# Altium project Artix Express UltraScale v2_2023-02-28T07_25_07_UTC.PrjPcb (part 7 of 7)
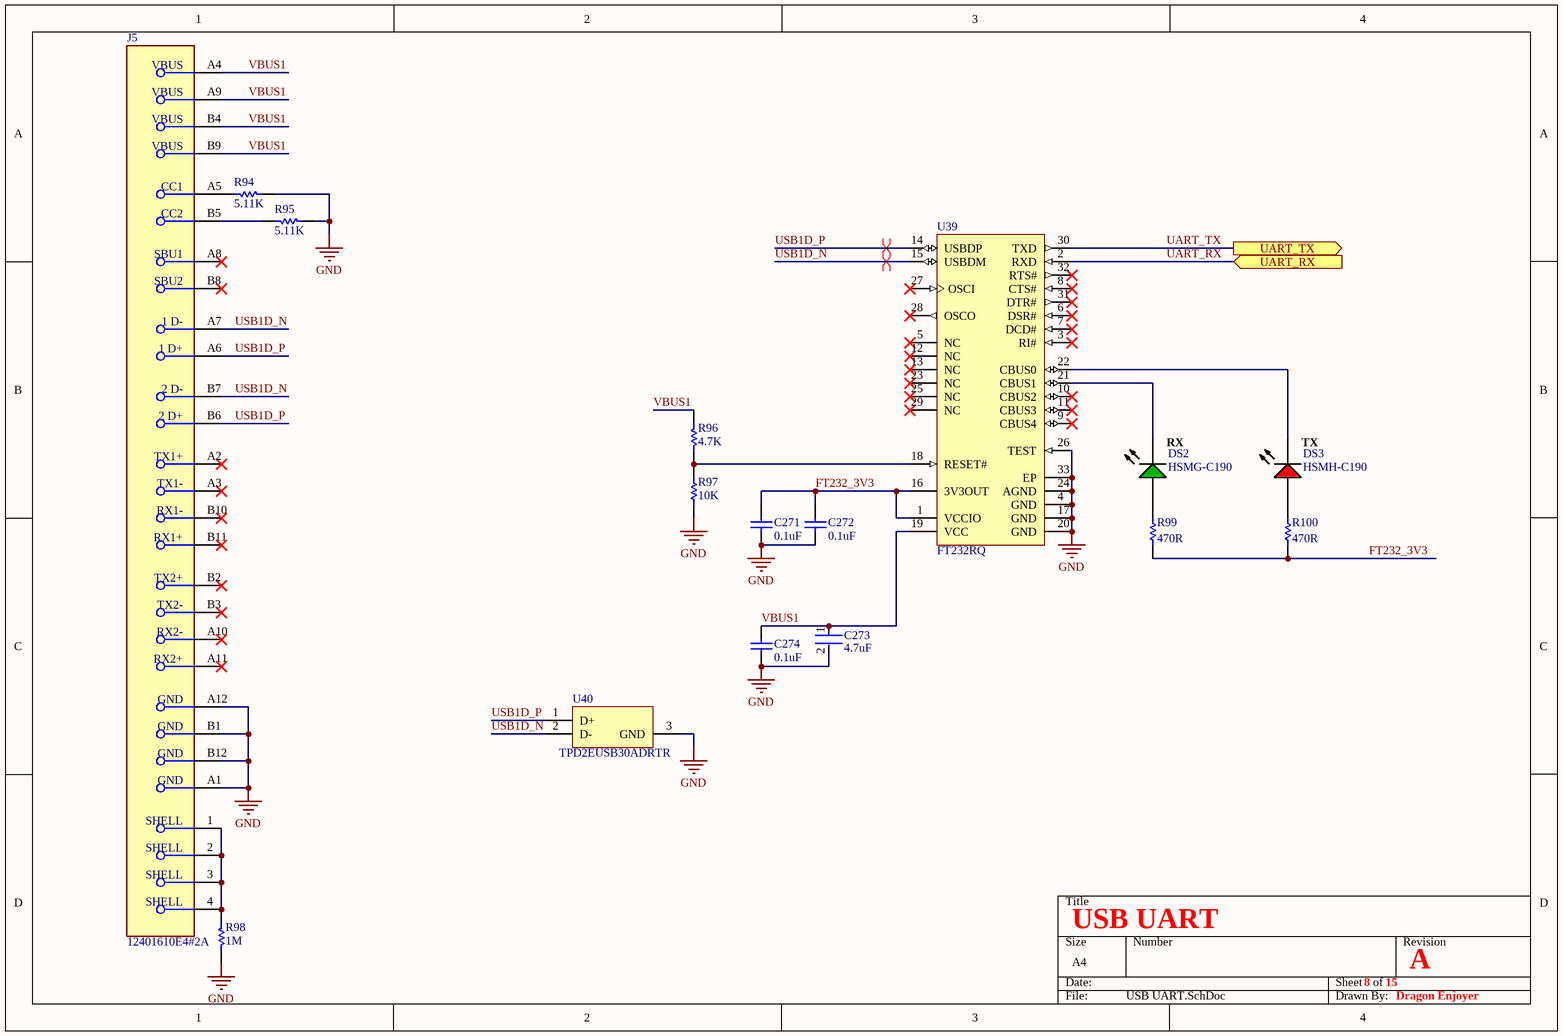
[diagram p23: USB UART.SchDoc]

## Nets that join several sheets
0.85V: FPGA Power (66 pins), Power Supplies (R1.2 U3.2)
0V9: FPGA Power (13 pins), Power Supplies (R16.2 U10.2)
1V2: DDR4 Memory (43 pins), FPGA Power (35 pins), FPGA Transcievers (R49.2 U12.AD8), Power Supplies (R9.2 U7.2)
1V8: FPGA Configuration (16 pins), FPGA IO (7 pins), FPGA Power (35 pins), Power Supplies (8 pins), USB JTAG (6 pins)
5V: Power Supplies (R3.2 U5.2), Thermal Control (U70.5)
+3V3: TopSheet (R115.2), DDR4 Memory (10 pins), FMC HPC Connector (12 pins), FPGA Configuration (5 pins), FPGA IO (25 pins), FPGA microSD (C403.2 Q3.2 R150.1 R156.2), FPGA Power (12 pins), LEDs (8 pins), Power Supplies (20 pins), Switches (8 pins), TempMonADC (7 pins), Thermal Control (U69.5), USB JTAG (18 pins)
+12: FMC HPC Connector (C195.2 C197.1 P15.C35 P15.C37), Power Supplies (39 pins), Thermal Control (C401.1 P10.2 R142.2)
GND: TopSheet (Q2.2), DDR4 Memory (58 pins), FMC HPC Connector (169 pins), FPGA Configuration (30 pins), FPGA IO (62 pins), FPGA microSD (10 pins), FPGA Power (269 pins), LEDs (16 pins), Power Supplies (94 pins), Switches (16 pins), TempMonADC (7 pins), Thermal Control (5 pins), USB JTAG (48 pins), USB UART (19 pins)
A0: DDR4 Memory (U19.L3), FPGA IO (U12.H24)
A1: DDR4 Memory (U19.L7), FPGA IO (U12.L24)
A2: DDR4 Memory (U19.M3), FPGA IO (U12.H22)
A3: DDR4 Memory (U19.K7), FPGA IO (U12.K25)
A4: DDR4 Memory (U19.K3), FPGA IO (U12.G26)
A5: DDR4 Memory (U19.L8), FPGA IO (U12.K26)
A6: DDR4 Memory (U19.L2), FPGA IO (U12.H23)
A7: DDR4 Memory (U19.M8), FPGA IO (U12.M25)
A8: DDR4 Memory (U19.M2), FPGA IO (U12.H26)
A9: DDR4 Memory (U19.M7), FPGA IO (U12.L23)
A10: DDR4 Memory (U19.J3), FPGA IO (U12.G25)
A11: DDR4 Memory (U19.N2), FPGA IO (U12.H21)
A12: DDR4 Memory (U19.J7), FPGA IO (U12.L22)
A13: DDR4 Memory (U19.N8), FPGA IO (U12.M26)
A14: DDR4 Memory (U19.H2), FPGA IO (U12.G24)
A15: DDR4 Memory (U19.H7), FPGA IO (U12.J25)
A16: DDR4 Memory (U19.H8), FPGA IO (U12.J26)
ACT_N: DDR4 Memory (U19.H3), FPGA IO (U12.J19)
BA0: DDR4 Memory (U19.K2), FPGA IO (U12.J23)
BA1: DDR4 Memory (U19.K8), FPGA IO (U12.L25)
BG0: DDR4 Memory (U19.J2), FPGA IO (U12.L18)
BG1: DDR4 Memory (U19.J8), FPGA IO (U12.J24)
CK_C: DDR4 Memory (R53.1 R54.2 U19.F8), FPGA IO (U12.F25)
CK_T: DDR4 Memory (R54.1 R55.1 U19.F7), FPGA IO (U12.F24)
CKE: DDR4 Memory (U19.G3), FPGA IO (U12.M20)
CS_N: DDR4 Memory (U19.G7), FPGA IO (U12.K18)
DDR_RST: DDR4 Memory (R56.2 U19.L1), FPGA IO (U12.J20)
DQ0: DDR4 Memory (U19.C2), FPGA IO (U12.D26)
DQ1: DDR4 Memory (U19.B7), FPGA IO (U12.B26)
DQ2: DDR4 Memory (U19.D3), FPGA IO (U12.D24)
DQ3: DDR4 Memory (U19.D7), FPGA IO (U12.C26)
DQ4: DDR4 Memory (U19.D2), FPGA IO (U12.D25)
DQ5: DDR4 Memory (U19.D8), FPGA IO (U12.B25)
DQ6: DDR4 Memory (U19.E3), FPGA IO (U12.E23)
DQ7: DDR4 Memory (U19.E7), FPGA IO (U12.F23)
DQS_C: DDR4 Memory (U19.B3), FPGA IO (U12.C24)
DQS_T: DDR4 Memory (U19.C3), FPGA IO (U12.D23)
FMC_DP0_RX_N: FMC HPC Connector (P15.C7), FPGA Transcievers (U12.V1)
FMC_DP0_RX_P: FMC HPC Connector (P15.C6), FPGA Transcievers (U12.V2)
FMC_DP0_TX_N: FMC HPC Connector (P15.C3), FPGA Transcievers (U12.AA4)
FMC_DP0_TX_P: FMC HPC Connector (P15.C2), FPGA Transcievers (U12.AA5)
FMC_DP1_RX_N: FMC HPC Connector (P15.A3), FPGA Transcievers (U12.Y1)
FMC_DP1_RX_P: FMC HPC Connector (P15.A2), FPGA Transcievers (U12.Y2)
FMC_DP1_TX_N: FMC HPC Connector (P15.A23), FPGA Transcievers (U12.U4)
FMC_DP1_TX_P: FMC HPC Connector (P15.A22), FPGA Transcievers (U12.U5)
FMC_DP2_RX_N: FMC HPC Connector (P15.A7), FPGA Transcievers (U12.T1)
FMC_DP2_RX_P: FMC HPC Connector (P15.A6), FPGA Transcievers (U12.T2)
FMC_DP2_TX_N: FMC HPC Connector (P15.A27), FPGA Transcievers (U12.R4)
FMC_DP2_TX_P: FMC HPC Connector (P15.A26), FPGA Transcievers (U12.R5)
FMC_DP3_RX_N: FMC HPC Connector (P15.A11), FPGA Transcievers (U12.P1)
FMC_DP3_RX_P: FMC HPC Connector (P15.A10), FPGA Transcievers (U12.P2)
FMC_DP3_TX_N: FMC HPC Connector (P15.A31), FPGA Transcievers (U12.K1)
FMC_DP3_TX_P: FMC HPC Connector (P15.A30), FPGA Transcievers (U12.K2)
FMC_DP4_RX_N: FMC HPC Connector (P15.A15), FPGA Transcievers (U12.H1)
FMC_DP4_RX_P: FMC HPC Connector (P15.A14), FPGA Transcievers (U12.H2)
FMC_DP4_TX_N: FMC HPC Connector (P15.A35), FPGA Transcievers (U12.L4)
FMC_DP4_TX_P: FMC HPC Connector (P15.A34), FPGA Transcievers (U12.L5)
FMC_DP5_RX_N: FMC HPC Connector (P15.A19), FPGA Transcievers (U12.W4)
FMC_DP5_RX_P: FMC HPC Connector (P15.A18), FPGA Transcievers (U12.W5)
FMC_DP5_TX_N: FMC HPC Connector (P15.A39), FPGA Transcievers (U12.G4)
FMC_DP5_TX_P: FMC HPC Connector (P15.A38), FPGA Transcievers (U12.G5)
FMC_DP6_RX_N: FMC HPC Connector (P15.B17), FPGA Transcievers (U12.F1)
FMC_DP6_RX_P: FMC HPC Connector (P15.B16), FPGA Transcievers (U12.F2)
FMC_DP6_TX_N: FMC HPC Connector (P15.B37), FPGA Transcievers (U12.J4)
FMC_DP6_TX_P: FMC HPC Connector (P15.B36), FPGA Transcievers (U12.J5)
FMC_DP7_RX_N: FMC HPC Connector (P15.B13), FPGA Transcievers (U12.M1)
FMC_DP7_RX_P: FMC HPC Connector (P15.B12), FPGA Transcievers (U12.M2)
FMC_DP7_TX_N: FMC HPC Connector (P15.B33), FPGA Transcievers (U12.N4)
FMC_DP7_TX_P: FMC HPC Connector (P15.B32), FPGA Transcievers (U12.N5)
FMC_GBTCLK0_M2C_N: FMC HPC Connector (P15.B21), FPGA Transcievers (C190.1)
FMC_GBTCLK0_M2C_P: FMC HPC Connector (P15.B20), FPGA Transcievers (C191.2)
FMC_GBTCLK1_M2C_N: FMC HPC Connector (P15.D5), FPGA Transcievers (C192.1)
FMC_GBTCLK1_M2C_P: FMC HPC Connector (P15.D4), FPGA Transcievers (C193.2)
FMC_IO_CLK0_N: FMC HPC Connector (P15.H5), FPGA IO (U12.B20)
FMC_IO_CLK0_P: FMC HPC Connector (P15.H4), FPGA IO (U12.B19)
FMC_IO_CLK1_N: FMC HPC Connector (P15.G3), FPGA IO (U12.D20)
FMC_IO_CLK1_P: FMC HPC Connector (P15.G2), FPGA IO (U12.D19)
FMC_IO_CLK2_N: FMC HPC Connector (P15.K5), FPGA IO (U12.C19)
FMC_IO_CLK2_P: FMC HPC Connector (P15.K4), FPGA IO (U12.C18)
FMC_IO_CLK3_N: FMC HPC Connector (P15.J3), FPGA IO (U12.D18)
FMC_IO_CLK3_P: FMC HPC Connector (P15.J2), FPGA IO (U12.E18)
FMC_IO_HA00_N: FMC HPC Connector (P15.F5), FPGA IO (U12.B24)
FMC_IO_HA00_P: FMC HPC Connector (P15.F4), FPGA IO (U12.B16)
FMC_IO_HA01_N: FMC HPC Connector (P15.E3), FPGA IO (U12.E22)
FMC_IO_HA01_P: FMC HPC Connector (P15.E2), FPGA IO (U12.C23)
FMC_IO_HA02_N: FMC HPC Connector (P15.K8), FPGA IO (U12.A20)
FMC_IO_HA02_P: FMC HPC Connector (P15.K7), FPGA IO (U12.A19)
FMC_IO_HA03_N: FMC HPC Connector (P15.J7), FPGA IO (U12.B17)
FMC_IO_HA03_P: FMC HPC Connector (P15.J6), FPGA IO (U12.C17)
FMC_IO_HA04_N: FMC HPC Connector (P15.F8), FPGA IO (U12.A15)
FMC_IO_HA04_P: FMC HPC Connector (P15.F7), FPGA IO (U12.B15)
FMC_IO_HA05_N: FMC HPC Connector (P15.E7), FPGA IO (U12.E17)
FMC_IO_HA05_P: FMC HPC Connector (P15.E6), FPGA IO (U12.E16)
FMC_IO_HA06_N: FMC HPC Connector (P15.K11), FPGA IO (U12.B21)
FMC_IO_HA06_P: FMC HPC Connector (P15.K10), FPGA IO (U12.C21)
FMC_IO_HA07_N: FMC HPC Connector (P15.J10), FPGA IO (U12.B22)
FMC_IO_HA07_P: FMC HPC Connector (P15.J9), FPGA IO (U12.C22)
FMC_IO_HA08_N: FMC HPC Connector (P15.F11), FPGA IO (U12.D21)
FMC_IO_HA08_P: FMC HPC Connector (P15.F10), FPGA IO (U12.E21)
FMC_IO_HA09_N: FMC HPC Connector (P15.E10), FPGA IO (U12.E20)
FMC_IO_HA09_P: FMC HPC Connector (P15.E9), FPGA IO (U12.F20)
FMC_IO_HA10_N: FMC HPC Connector (P15.K14), FPGA IO (U12.N22)
FMC_IO_HA10_P: FMC HPC Connector (P15.K13), FPGA IO (U12.N21)
FMC_IO_HA11_N: FMC HPC Connector (P15.J13), FPGA IO (U12.G17)
FMC_IO_HA11_P: FMC HPC Connector (P15.J12), FPGA IO (U12.H17)
FMC_IO_HA12_N: FMC HPC Connector (P15.F14), FPGA IO (U12.F19)
FMC_IO_HA12_P: FMC HPC Connector (P15.F13), FPGA IO (U12.F18)
FMC_IO_HA13_N: FMC HPC Connector (P15.E13), FPGA IO (U12.D15)
FMC_IO_HA13_P: FMC HPC Connector (P15.E12), FPGA IO (U12.E15)
FMC_IO_HA14_N: FMC HPC Connector (P15.J16), FPGA IO (U12.R23)
FMC_IO_HA14_P: FMC HPC Connector (P15.J15), FPGA IO (U12.R22)
FMC_IO_HA15_N: FMC HPC Connector (P15.F17), FPGA IO (U12.P19)
FMC_IO_HA15_P: FMC HPC Connector (P15.F16), FPGA IO (U12.N19)
FMC_IO_HA16_N: FMC HPC Connector (P15.E16), FPGA IO (U12.P24)
FMC_IO_HA16_P: FMC HPC Connector (P15.E15), FPGA IO (U12.N24)
FMC_IO_HA17_N: FMC HPC Connector (P15.K17), FPGA IO (U12.U20)
FMC_IO_HA17_P: FMC HPC Connector (P15.K16), FPGA IO (U12.T20)
FMC_IO_HA18_N: FMC HPC Connector (P15.J19), FPGA IO (U12.Y23)
FMC_IO_HA18_P: FMC HPC Connector (P15.J18), FPGA IO (U12.Y22)
FMC_IO_HA19_N: FMC HPC Connector (P15.F20), FPGA IO (U12.AB22)
FMC_IO_HA19_P: FMC HPC Connector (P15.F19), FPGA IO (U12.AA22)
FMC_IO_HA20_N: FMC HPC Connector (P15.E19), FPGA IO (U12.AC21)
FMC_IO_HA20_P: FMC HPC Connector (P15.E18), FPGA IO (U12.AB21)
FMC_IO_HA21_N: FMC HPC Connector (P15.K20), FPGA IO (U12.Y21)
FMC_IO_HA21_P: FMC HPC Connector (P15.K19), FPGA IO (U12.Y20)
FMC_IO_HA22_N: FMC HPC Connector (P15.J22), FPGA IO (U12.R26)
FMC_IO_HA22_P: FMC HPC Connector (P15.J21), FPGA IO (U12.R25)
FMC_IO_HA23_N: FMC HPC Connector (P15.K23), FPGA IO (U12.U25)
FMC_IO_HA23_P: FMC HPC Connector (P15.K22), FPGA IO (U12.T25)
FMC_IO_HB00_N: FMC HPC Connector (P15.K26), FPGA IO (U12.AC23)
FMC_IO_HB00_P: FMC HPC Connector (P15.K25), FPGA IO (U12.AC22)
FMC_IO_HB01_N: FMC HPC Connector (P15.J25), FPGA IO (U12.W26)
FMC_IO_HB01_P: FMC HPC Connector (P15.J24), FPGA IO (U12.W25)
FMC_IO_HB02_N: FMC HPC Connector (P15.F23), FPGA IO (U12.T23)
FMC_IO_HB02_P: FMC HPC Connector (P15.F22), FPGA IO (U12.T22)
FMC_IO_HB03_N: FMC HPC Connector (P15.E22), FPGA IO (U12.AF22)
FMC_IO_HB03_P: FMC HPC Connector (P15.E21), FPGA IO (U12.AE22)
FMC_IO_HB04_N: FMC HPC Connector (P15.F26), FPGA IO (U12.AA17)
FMC_IO_HB04_P: FMC HPC Connector (P15.F25), FPGA IO (U12.Y17)
FMC_IO_HB05_N: FMC HPC Connector (P15.E25), FPGA IO (U12.W20)
FMC_IO_HB05_P: FMC HPC Connector (P15.E24), FPGA IO (U12.W19)
FMC_IO_HB06_N: FMC HPC Connector (P15.K29), FPGA IO (U12.AE21)
FMC_IO_HB06_P: FMC HPC Connector (P15.K28), FPGA IO (U12.AD21)
FMC_IO_HB07_N: FMC HPC Connector (P15.J28), FPGA IO (U12.AB26)
FMC_IO_HB07_P: FMC HPC Connector (P15.J27), FPGA IO (U12.AB25)
FMC_IO_HB08_N: FMC HPC Connector (P15.F29), FPGA IO (U12.AD26)
FMC_IO_HB08_P: FMC HPC Connector (P15.F28), FPGA IO (U12.AC26)
FMC_IO_HB09_N: FMC HPC Connector (P15.E28), FPGA IO (U12.AD25)
FMC_IO_HB09_P: FMC HPC Connector (P15.E27), FPGA IO (U12.AD24)
FMC_IO_HB10_N: FMC HPC Connector (P15.K32), FPGA IO (U12.AE23)
FMC_IO_HB10_P: FMC HPC Connector (P15.K31), FPGA IO (U12.AD23)
FMC_IO_HB11_N: FMC HPC Connector (P15.J31), FPGA IO (U12.AE26)
FMC_IO_HB11_P: FMC HPC Connector (P15.J30), FPGA IO (U12.AE25)
FMC_IO_HB12_N: FMC HPC Connector (P15.H38), FPGA IO (U12.AE16)
FMC_IO_HB12_P: FMC HPC Connector (P15.H37), FPGA IO (U12.AD16)
FMC_IO_HB13_N: FMC HPC Connector (P15.G34), FPGA IO (U12.AF17)
FMC_IO_HB13_P: FMC HPC Connector (P15.G33), FPGA IO (U12.AE17)
FMC_IO_HB14_N: FMC HPC Connector (P15.K35), FPGA IO (U12.AF19)
FMC_IO_HB14_P: FMC HPC Connector (P15.K34), FPGA IO (U12.AF18)
FMC_IO_LA00_N: FMC HPC Connector (P15.G7), FPGA IO (U12.C16)
FMC_IO_LA00_P: FMC HPC Connector (P15.G6), FPGA IO (U12.D16)
FMC_IO_LA01_N: FMC HPC Connector (P15.D9), FPGA IO (U12.G19)
FMC_IO_LA01_P: FMC HPC Connector (P15.D8), FPGA IO (U12.F17)
FMC_IO_LA02_N: FMC HPC Connector (P15.H8), FPGA IO (U12.A18)
FMC_IO_LA02_P: FMC HPC Connector (P15.H7), FPGA IO (U12.A17)
FMC_IO_LA03_N: FMC HPC Connector (P15.G10), FPGA IO (U12.A23)
FMC_IO_LA03_P: FMC HPC Connector (P15.G9), FPGA IO (U12.A22)
FMC_IO_LA04_N: FMC HPC Connector (P15.H11), FPGA IO (U12.A25)
FMC_IO_LA04_P: FMC HPC Connector (P15.H10), FPGA IO (U12.A24)
FMC_IO_LA05_N: FMC HPC Connector (P15.D12), FPGA IO (U12.G21)
FMC_IO_LA05_P: FMC HPC Connector (P15.D11), FPGA IO (U12.G20)
FMC_IO_LA06_N: FMC HPC Connector (P15.C11), FPGA IO (U12.H19)
FMC_IO_LA06_P: FMC HPC Connector (P15.C10), FPGA IO (U12.H18)
FMC_IO_LA07_N: FMC HPC Connector (P15.H14), FPGA IO (U12.G16)
FMC_IO_LA07_P: FMC HPC Connector (P15.H13), FPGA IO (U12.H16)
FMC_IO_LA08_N: FMC HPC Connector (P15.G13), FPGA IO (U12.F15)
FMC_IO_LA08_P: FMC HPC Connector (P15.G12), FPGA IO (U12.G15)
FMC_IO_LA09_N: FMC HPC Connector (P15.D15), FPGA IO (U12.P23)
FMC_IO_LA09_P: FMC HPC Connector (P15.D14), FPGA IO (U12.N23)
FMC_IO_LA10_N: FMC HPC Connector (P15.C15), FPGA IO (U12.AA23)
FMC_IO_LA10_P: FMC HPC Connector (P15.C14), FPGA IO (U12.W21)
FMC_IO_LA11_N: FMC HPC Connector (P15.H17), FPGA IO (U12.R21)
FMC_IO_LA11_P: FMC HPC Connector (P15.H16), FPGA IO (U12.R20)
FMC_IO_LA12_N: FMC HPC Connector (P15.G37), FPGA IO (U12.AC17)
FMC_IO_LA12_P: FMC HPC Connector (P15.G36), FPGA IO (U12.AB17)
FMC_IO_LA13_N: FMC HPC Connector (P15.D18), FPGA IO (U12.U22)
FMC_IO_LA13_P: FMC HPC Connector (P15.D17), FPGA IO (U12.U21)
FMC_IO_LA14_N: FMC HPC Connector (P15.C19), FPGA IO (U12.AE20)
FMC_IO_LA14_P: FMC HPC Connector (P15.C18), FPGA IO (U12.AD20)
FMC_IO_LA15_N: FMC HPC Connector (P15.H20), FPGA IO (U12.W23)
FMC_IO_LA15_P: FMC HPC Connector (P15.H19), FPGA IO (U12.V23)
FMC_IO_LA16_N: FMC HPC Connector (P15.G19), FPGA IO (U12.V22)
FMC_IO_LA16_P: FMC HPC Connector (P15.G18), FPGA IO (U12.V21)
FMC_IO_LA17_N: FMC HPC Connector (P15.H34), FPGA IO (U12.AC16)
FMC_IO_LA17_P: FMC HPC Connector (P15.H35), FPGA IO (U12.AE18)
FMC_IO_LA18_N: FMC HPC Connector (P15.C23), FPGA IO (U12.AA18)
FMC_IO_LA18_P: FMC HPC Connector (P15.C22), FPGA IO (U12.Y18)
FMC_IO_LA19_N: FMC HPC Connector (P15.H23), FPGA IO (U12.P26)
FMC_IO_LA19_P: FMC HPC Connector (P15.H22), FPGA IO (U12.P25)
FMC_IO_LA20_N: FMC HPC Connector (P15.G22), FPGA IO (U12.U24)
FMC_IO_LA20_P: FMC HPC Connector (P15.G21), FPGA IO (U12.T24)
FMC_IO_LA21_N: FMC HPC Connector (P15.H26), FPGA IO (U12.V26)
FMC_IO_LA21_P: FMC HPC Connector (P15.H25), FPGA IO (U12.U26)
FMC_IO_LA22_N: FMC HPC Connector (P15.G25), FPGA IO (U12.W24)
FMC_IO_LA22_P: FMC HPC Connector (P15.G24), FPGA IO (U12.V24)
FMC_IO_LA23_N: FMC HPC Connector (P15.D24), FPGA IO (U12.AB19)
FMC_IO_LA23_P: FMC HPC Connector (P15.D23), FPGA IO (U12.AA19)
FMC_IO_LA24_N: FMC HPC Connector (P15.H29), FPGA IO (U12.AC24)
FMC_IO_LA24_P: FMC HPC Connector (P15.H28), FPGA IO (U12.AB24)
FMC_IO_LA25_N: FMC HPC Connector (P15.G28), FPGA IO (U12.AA25)
FMC_IO_LA25_P: FMC HPC Connector (P15.G27), FPGA IO (U12.AA24)
FMC_IO_LA26_N: FMC HPC Connector (P15.D27), FPGA IO (U12.V19)
FMC_IO_LA26_P: FMC HPC Connector (P15.D26), FPGA IO (U12.U19)
FMC_IO_LA27_N: FMC HPC Connector (P15.C27), FPGA IO (U12.Y26)
FMC_IO_LA27_P: FMC HPC Connector (P15.C26), FPGA IO (U12.Y25)
FMC_IO_LA28_N: FMC HPC Connector (P15.H32), FPGA IO (U12.AD19)
FMC_IO_LA28_P: FMC HPC Connector (P15.H31), FPGA IO (U12.AC19)
FMC_IO_LA29_N: FMC HPC Connector (P15.G31), FPGA IO (U12.AF25)
FMC_IO_LA29_P: FMC HPC Connector (P15.G30), FPGA IO (U12.AF24)
FMC_IO_LA30_N: FMC HPC Connector (P15.D20), FPGA IO (U12.AB20)
FMC_IO_LA30_P: FMC HPC Connector (P15.D21), FPGA IO (U12.AA20)
FMC_IO_LA31_N: FMC HPC Connector (P15.E31), FPGA IO (U12.AD18)
FMC_IO_LA31_P: FMC HPC Connector (P15.E30), FPGA IO (U12.AC18)
FMC_IO_LA32_N: FMC HPC Connector (P15.F32), FPGA IO (U12.AF20)
FMC_IO_LA32_P: FMC HPC Connector (P15.F31), FPGA IO (U12.AF23)
FMC_IO_LA33_N: FMC HPC Connector (P15.G16), FPGA IO (U12.P21)
FMC_IO_LA33_P: FMC HPC Connector (P15.G15), FPGA IO (U12.P20)
FMC_PRSNT: FMC HPC Connector (P15.H2 R76.1 U25.1), FPGA IO (U12.N26)
FMC_SCL: FMC HPC Connector (P15.C30), FPGA IO (R29.2 U24.9)
FMC_SDA: FMC HPC Connector (P15.C31), FPGA IO (R30.2 U24.8)
FPGA_TCK: FPGA Configuration (J15.6 U12.AE12), USB JTAG (U42.4)
FPGA_TDI: FPGA Configuration (J15.10 U12.AB12), USB JTAG (U41.4)
FPGA_TDO: FPGA Configuration (J15.8 U12.Y10), USB JTAG (U43.2)
FPGA_TMS: FPGA Configuration (J15.4 U12.AB10), USB JTAG (U44.4)
ISNS_SCL: FPGA IO (R25.2 U24.5), Power Supplies (9 pins)
ISNS_SDA: FPGA IO (R26.2 U24.4), Power Supplies (8 pins)
LED0: FPGA IO (U12.B14), LEDs (R179.1 R181.2)
LED1: FPGA IO (U12.A13), LEDs (R185.1 R187.2)
LED2: FPGA IO (U12.B12), LEDs (R191.1 R193.2)
LED3: FPGA IO (U12.A12), LEDs (R71.1 R73.2)
LED4: FPGA IO (U12.C13), LEDs (R180.1 R182.2)
LED5: FPGA IO (U12.C14), LEDs (R186.1 R188.2)
LED6: FPGA IO (U12.C12), LEDs (R192.1 R194.2)
LED7: FPGA IO (U12.A14), LEDs (R72.1 R74.2)
NetR83_2: FPGA IO (U24.11), TempMonADC (R83.2 U26.7)
NetR84_2: FPGA IO (U24.10), TempMonADC (R84.2 U26.8)
NetU1_F3: Power Supplies (U1.F3), TempMonADC (U26.3)
NetU2_F3: Power Supplies (U2.F3), TempMonADC (U26.1)
NetU12_W12: FPGA IO (U12.W12), Thermal Control (U69.4)
NetU12_W13: FPGA IO (U12.W13), Thermal Control (U70.2)
ODT: DDR4 Memory (U19.F3), FPGA IO (U12.M21)
PCIE_REFCLK_N: TopSheet (C307.2), FPGA Transcievers (U12.AB6)
PCIE_REFCLK_P: TopSheet (C308.2), FPGA Transcievers (U12.AB7)
PCIE_TXL0_N: TopSheet (C304.1), FPGA Transcievers (U12.AF6)
PCIE_TXL0_P: TopSheet (C303.1), FPGA Transcievers (U12.AF7)
PCIE_TXL1_N: TopSheet (C306.1), FPGA Transcievers (U12.AE8)
PCIE_TXL1_P: TopSheet (C305.1), FPGA Transcievers (U12.AE9)
PCIE_TXL2_N: TopSheet (C302.1), FPGA Transcievers (U12.AD6)
PCIE_TXL2_P: TopSheet (C301.1), FPGA Transcievers (U12.AD7)
PCIE_TXL3_N: TopSheet (C300.1), FPGA Transcievers (U12.AC4)
PCIE_TXL3_P: TopSheet (C299.1), FPGA Transcievers (U12.AC5)
PCIE_WAKE: TopSheet (Q2.1), FPGA IO (U12.AA13)
SD_CD: FPGA IO (U12.G12), FPGA microSD (R156.1 R157.2 U73.4 U73.7)
SD_CLK: FPGA IO (U12.E12), FPGA microSD (CD2.5 U74.5 U74.6)
SD_CMD: FPGA IO (U12.D13), FPGA microSD (CD2.3 R153.2 U74.4 U74.7)
SD_D0: FPGA IO (U12.F12), FPGA microSD (CD2.7 R152.2 U73.1 U73.10)
SD_D1: FPGA IO (U12.F13), FPGA microSD (CD2.8 R151.2 U73.2 U73.9)
SD_D2: FPGA IO (U12.D14), FPGA microSD (CD2.1 R155.2 U74.1 U74.10)
SD_D3: FPGA IO (U12.E13), FPGA microSD (CD2.2 R154.2 U74.2 U74.9)
SD_RST: FPGA IO (U12.F14), FPGA microSD (Q3.1 R150.2)
SW0: FPGA IO (U12.H11), Switches (R8.5)
SW1: FPGA IO (U12.G11), Switches (R8.6)
SW2: FPGA IO (U12.J11), Switches (R8.7)
SW3: FPGA IO (U12.J10), Switches (R8.8)
SW4: FPGA IO (U12.K10), Switches (R11.8)
SW5: FPGA IO (U12.K9), Switches (R11.7)
SW6: FPGA IO (U12.H9), Switches (R11.6)
SW7: FPGA IO (U12.J9), Switches (R11.5)
TDQS_T: DDR4 Memory (U19.A7), FPGA IO (U12.E25)
TSNS_SCL: FPGA Configuration (U17.7), FPGA IO (R27.2 U24.7)
TSNS_SDA: FPGA Configuration (U17.6), FPGA IO (R28.2 U24.6)
UART_RX: FPGA IO (U12.H13), USB UART (U39.2)
UART_TX: FPGA IO (U12.H14), USB UART (U39.30)